# EAGLE schematic SerLCD_16x2_FRITZTING (EAGLE 7.6.0)
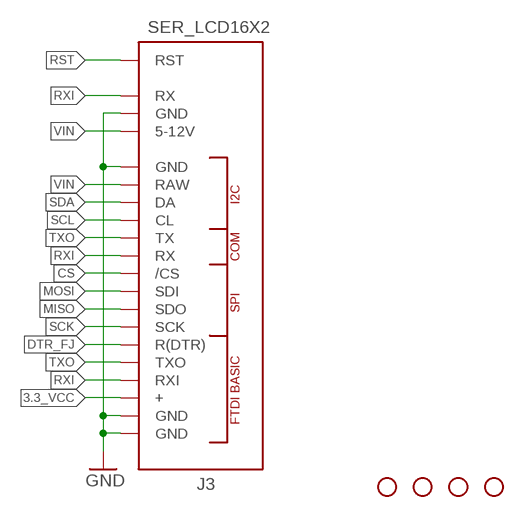
[diagram p0: schematic, sheet 1]

## Parts
H1  STAND-OFF  [STAND-OFF]
H2  STAND-OFF  [STAND-OFF]
H3  STAND-OFF  [STAND-OFF]
H4  STAND-OFF  [STAND-OFF]
J3  SER_LCD16X2  [SER_LCD_16X2]

## Nets
3.3_VCC: J3.P$3(+)
CS: J3.P$10(/CS)
DTR_FJ: J3.P$6(R(DTR))
GND [twelve_mil]: J3.P$1(GND) J3.P$2(GND) J3.P$16(GND) J3.P$18(GND)
MISO: J3.P$8(SDO)
MOSI: J3.P$9(SDI)
RST: J3.P$20(RST)
RXI: J3.P$4(RXI) J3.P$11(RX) J3.P$19(RX)
SCK: J3.P$7(SCK)
SCL: J3.P$13(CL)
SDA: J3.P$14(DA)
TXO: J3.P$5(TXO) J3.P$12(TX)
VIN: J3.P$15(RAW) J3.P$17(5-12V)

## Library data of the parts
H1-H4 = SparkFun-Hardware:STAND-OFF: Stand Off Drill holes for mechanically mounting via screws, standoffs, etc. Note: Use the keepout ring to avoid running the screw head into surrounding components. Variant Overviews STAND-OFF - Mechanical footprint for a #4 phillips button head screw. STAND-OFF-TIGHT - Mechanical footprint for a #4 phillips button head screw, Example SparkFun Products Screw - Phillips Head (1/4", 4-40, 10 pack) <https://www.sparkfun.com/products/10453> (PRT-10453) Screw - Phillips Head (1/2", 4-40, 10 pack) <https://www.sparkfun.com/products/10452> (PRT-10452) Screw - Phillips Head (3/4", 4-40, 10 pack) <https://www.sparkfun.com/products/10451> (PRT-10451) Screw - Phillips Head (1", 4-40, 10 pack) <https://www.sparkfun.com/products/10450> (PRT-10450)
J3 = SerLCD_16x2_FRITZTING:SER_LCD

## Net classes
9 twelve_mil: width 0.305 mm, clearance 0.127 mm